# Altium schematic sheet Microcontroller.SchDoc
size A3; Date: 29/01/2025; Engineer: Emirhan BOZKURT; SheetNumber: 4; SheetTotal: 5; PageSize: A3; Position: R&D Electronics Engineer
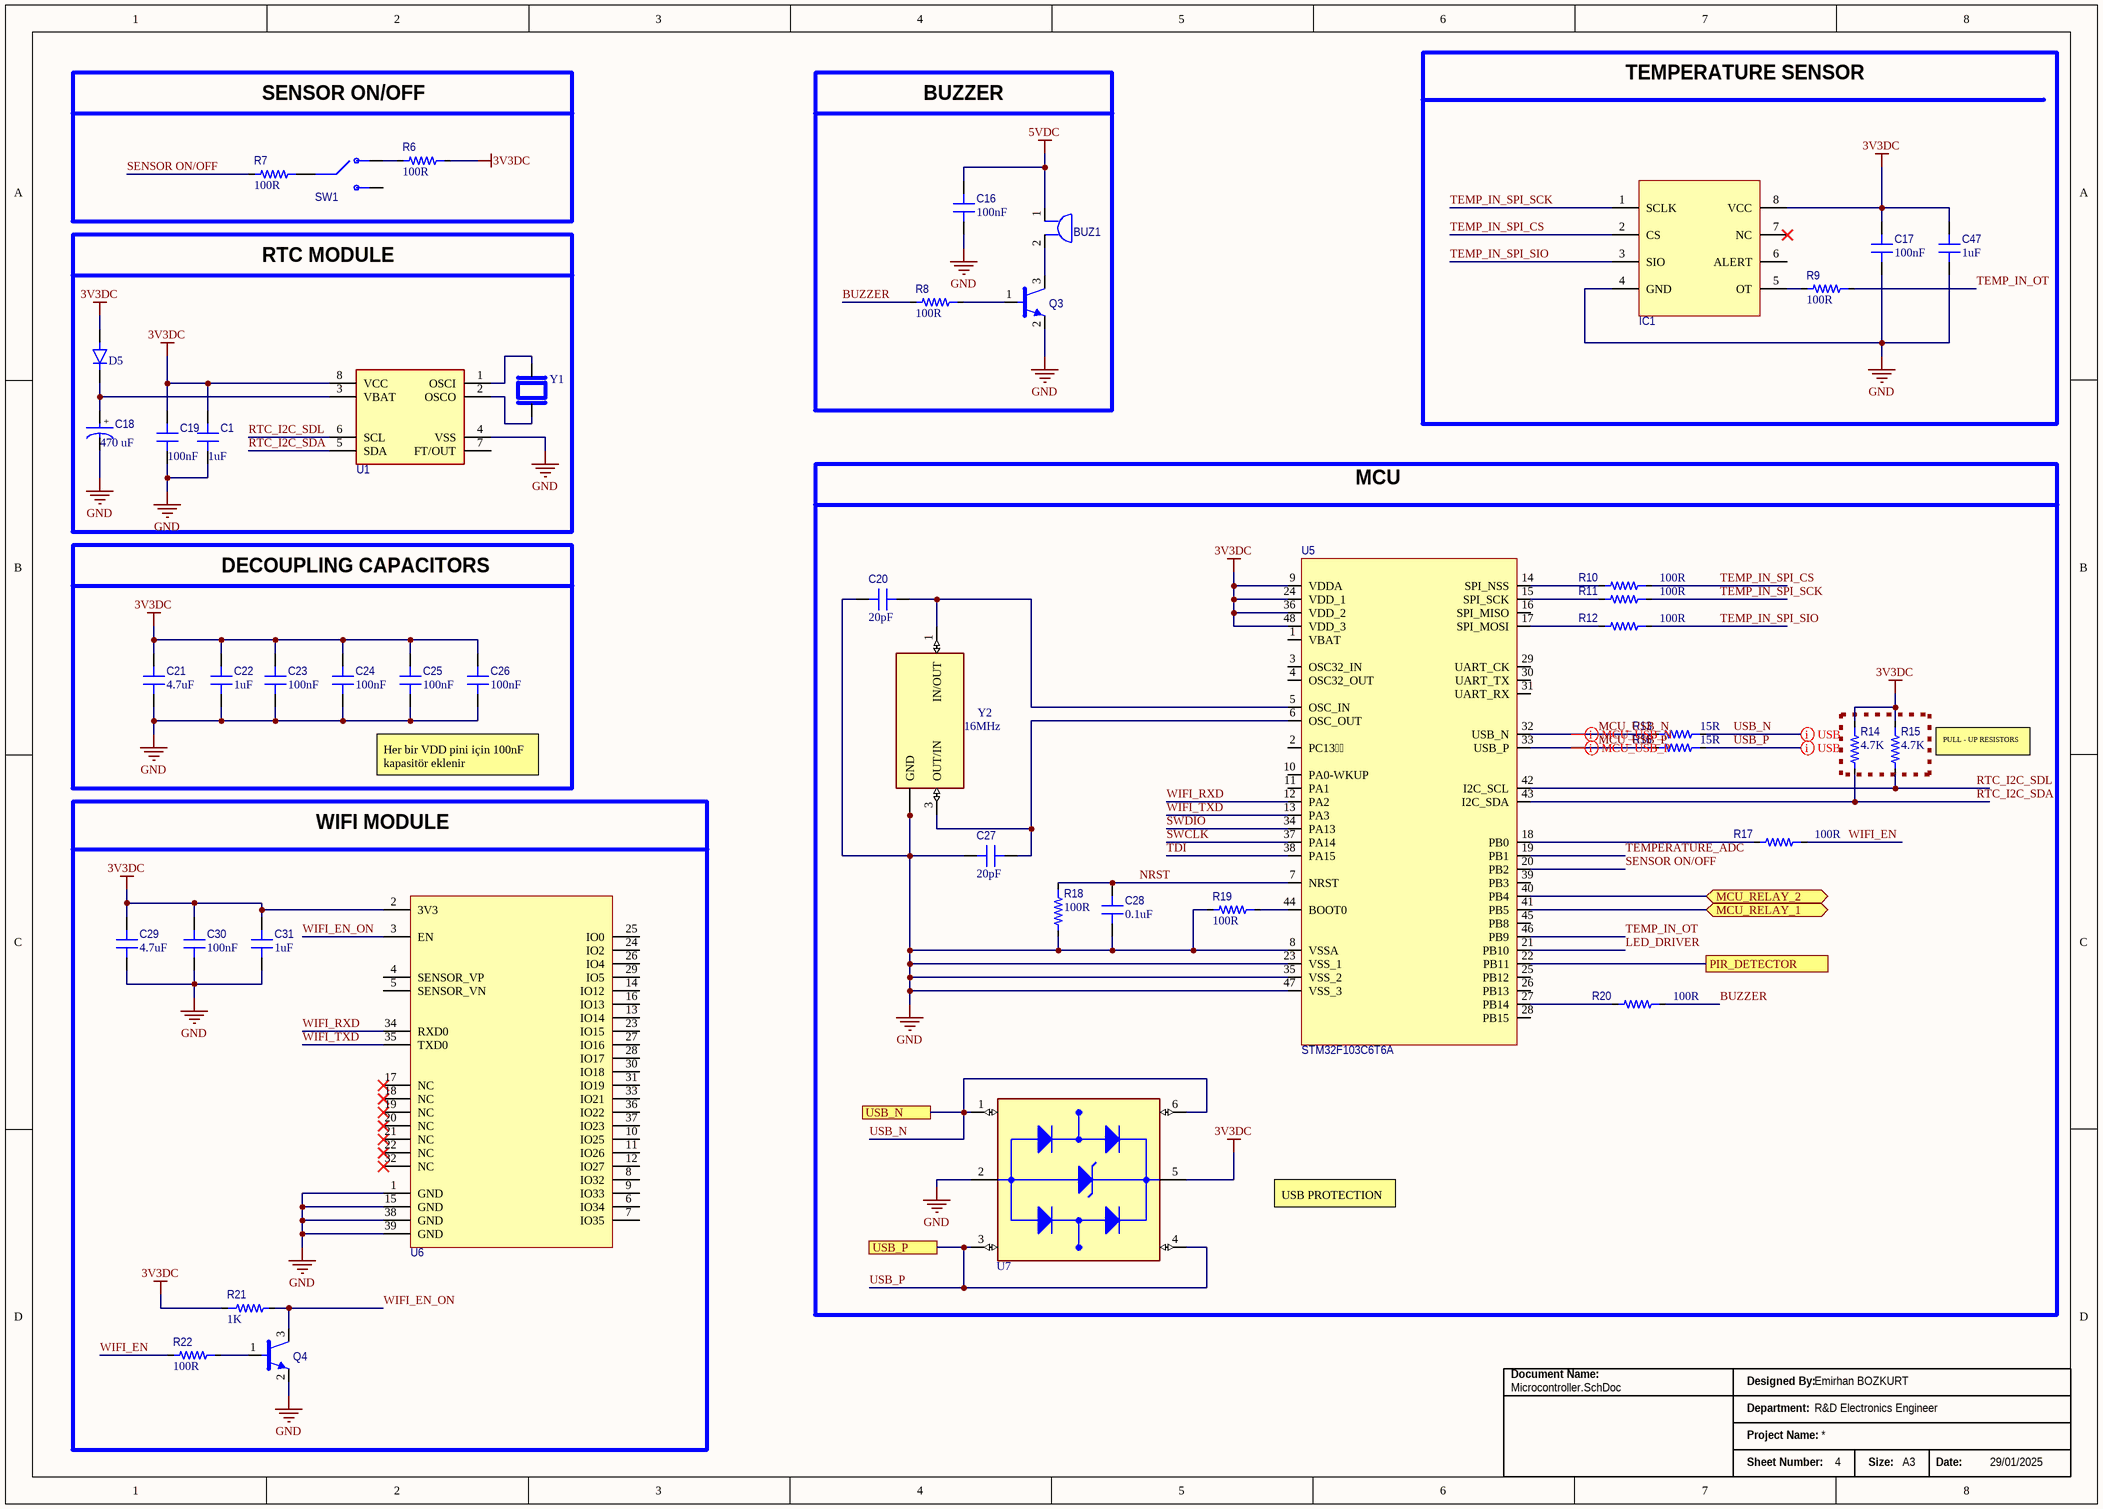
[diagram p0: Microcontroller.SchDoc]

## Parts
BUZ1  CMI-9605IC-0580T  [CMI-9605IC-0580T]  (value not drawn)
C1  value 1uF  [CAP_0805]  (hidden comment: CL21B105KBFNNNE)
C16  value 100nF  [CAP_0805]  (hidden comment: 1276-1003-2-ND)
C17  value 100nF  [CAP_0805]  (hidden comment: 1276-1003-2-ND)
C18  value 470 uF  [CAP_ALU_470UF_SMD]  (hidden comment: PCR1E471MCL1GS)
C19  value 100nF  [CAP_0805]  (hidden comment: 1276-1003-2-ND)
C20  value 20pF  [CAP_0603]  (hidden comment: C0603C104K4RACTU)
C21  value 4.7uF  [CAP_0805]  (hidden comment: CL21A475KAQNNNE)
C22  value 1uF  [CAP_0805]  (hidden comment: CL21B105KBFNNNE)
C23  value 100nF  [CAP_0805]  (hidden comment: 1276-1003-2-ND)
C24  value 100nF  [CAP_0805]  (hidden comment: 1276-1003-2-ND)
C25  value 100nF  [CAP_0805]  (hidden comment: 1276-1003-2-ND)
C26  value 100nF  [CAP_0805]  (hidden comment: 1276-1003-2-ND)
C27  value 20pF  [CAP_0603]  (hidden comment: C0603C104K4RACTU)
C28  value 0.1uF  [CAP_0603]  (hidden comment: C0603C104K4RACTU)
C29  value 4.7uF  [CAP_0805]  (hidden comment: CL21A475KAQNNNE)
C30  value 100nF  [CAP_0805]  (hidden comment: 1276-1003-2-ND)
C31  value 1uF  [CAP_0805]  (hidden comment: CL21B105KBFNNNE)
C47  value 1uF  [CAP_0805]  (hidden comment: CL21B105KBFNNNE)
D5  1N4148WS  [1N4148WS]  (value not drawn)
IC1  MAX6662MSA+  [SOIC-8]  (value not drawn)
Q3  MMBT3904-7-F  [SOT-23F]  (value not drawn)
Q4  MMBT3904-7-F  [SOT-23F]  (value not drawn)
R6  value 100R  [RES_0603]  (hidden comment: RC0603FR-07100RL)
R7  value 100R  [RES_0603]  (hidden comment: RC0603FR-07100RL)
R8  value 100R  [RES_0603]  (hidden comment: RC0603FR-07100RL)
R9  value 100R  [RES_0603]  (hidden comment: RC0603FR-07100RL)
R10  value 100R  [RES_0603]  (hidden comment: RC0603FR-07100RL)
R11  value 100R  [RES_0603]  (hidden comment: RC0603FR-07100RL)
R12  value 100R  [RES_0603]  (hidden comment: RC0603FR-07100RL)
R13  value 15R  [RES_0603]  (hidden comment: RC0603FR-0715RL)
R14  value 4.7K  [RES_0603]  (hidden comment: RC0603FR-074K7L)
R15  value 4.7K  [RES_0603]  (hidden comment: RC0603FR-074K7L)
R16  value 15R  [RES_0603]  (hidden comment: RC0603FR-0715RL)
R17  value 100R  [RES_0603]  (hidden comment: RC0603FR-07100RL)
R18  value 100R  [RES_0603]  (hidden comment: RC0603FR-07100RL)
R19  value 100R  [RES_0603]  (hidden comment: RC0603FR-07100RL)
R20  value 100R  [RES_0603]  (hidden comment: RC0603FR-07100RL)
R21  value 1K  [RES_0603]  (hidden comment: RC0603FR-071KL)
R22  value 100R  [RES_0603]  (hidden comment: RC0603FR-07100RL)
SW1  EG1215AA  [EG1215AA]  (value not drawn)
U1  M41T00M6F  [SOIC-8]  (value not drawn)
U5  STM32F103C6T6A  [LQFP-48]
U6  ESP32-WROOM-32E-N4  [ESP32-WROOM-32E]  (value not drawn)
U7  USBLC6-2SC6  [SOT95P280X145-6N]  (value not drawn)
Y1  ABS05-32.768KHZ-T  [XTAL_ABS05-32.768KHZ-T]  (value not drawn)
Y2  value 16MHz  [XTAL_ECS-160-20-30B-TR]  (hidden comment: ECS-160-20-30B-TR)

## Blocks framed on the sheet
TEMPERATURE SENSOR: C17 C47 IC1 R9
SENSOR ON/OFF: R6 R7 SW1
BUZZER: BUZ1 C16 Q3 R8
RTC MODULE: C1 C18 C19 D5 U1 Y1
MCU: C20 C27 C28 R10-R20 U5 U7 Y2
DECOUPLING CAPACITORS: C21-C26
WIFI MODULE: C29-C31 Q4 R21 R22 U6

## Ports
MCU_RELAY_1 (bidir), MCU_RELAY_2 (bidir), PIR_DETECTOR, USB_N, USB_P

## Nets
3V3DC: C1.2 C17.2 C19.2 C21.2 C22.2 C23.2 C24.2 C25.2 C26.2 C29.2 C30.2 C31.2 C47.2 D5.A IC1.8(VCC) R6.2 R14.2 R15.2 R21.2 U1.8(VCC) U5.9(VDDA) U5.24(VDD_1) U5.36(VDD_2) U5.48(VDD_3) U6.2(3V3) U7.5(VBUS)
5VDC: BUZ1.1 C16.2
GND: C1.1 C16.1 C17.1 C18.2 C19.1 C20.1 C21.1 C22.1 C23.1 C24.1 C25.1 C26.1 C27.1 C28.1 C29.1 C30.1 C31.1 C47.1 IC1.4(GND) Q3.2(E) Q4.2(E) R18.1 R19.1 U1.4(VSS) U5.8(VSSA) U5.23(VSS_1) U5.35(VSS_2) U5.47(VSS_3) U6.1(GND) U6.15(GND) U6.38(GND) U6.39(GND) U7.2(GND) Y2.2(GND) Y2.4(GND)
BUZZER: R8.1 R20.2
LED_DRIVER: U5.21(PB10)
MCU_RELAY_1: U5.41(PB5) ; port MCU_RELAY_1
MCU_RELAY_2: U5.40(PB4) ; port MCU_RELAY_2
MCU_USB_N: R13.1 U5.32(USB_N)
MCU_USB_P: R16.1 U5.33(USB_P)
NRST: C28.2 R18.2 U5.7(NRST)
PIR_DETECTOR: U5.22(PB11) ; port PIR_DETECTOR
RTC_I2C_SDA: R14.1 U1.5(SDA) U5.43(I2C_SDA)
RTC_I2C_SDL: R15.1 U1.6(SCL) U5.42(I2C_SCL)
SENSOR ON/OFF: R7.1 U5.20(PB2)
SWCLK: U5.37(PA14)
SWDIO: U5.34(PA13)
TDI: U5.38(PA15)
TEMP_IN_OT: R9.2 U5.46(PB9)
TEMP_IN_SPI_CS: IC1.2(CS) R10.2
TEMP_IN_SPI_SCK: IC1.1(SCLK) R11.2
TEMP_IN_SPI_SIO: IC1.3(SIO) R12.2
TEMPERATURE_ADC: U5.19(PB1)
USB_N: R13.2 U7.1(I/O1_IN) U7.6(I/O1_OUT) ; port USB_N
USB_P: R16.2 U7.3(I/O2_IN) U7.4(I/O2_OUT) ; port USB_P
WIFI_EN: R17.2 R22.1
WIFI_EN_ON: Q4.3(C) R21.1 U6.3(EN)
WIFI_RXD: U5.12(PA2) U6.34(RXD0)
WIFI_TXD: U5.13(PA3) U6.35(TXD0)
NetBUZ1_2: BUZ1.2 Q3.3(C)
NetC18_1: C18.1 D5.C U1.3(VBAT)
NetC20_2: C20.2 U5.5(OSC_IN) Y2.1(IN/OUT)
NetC27_2: C27.2 U5.6(OSC_OUT) Y2.3(OUT/IN)
NetIC1_5: IC1.5(OT) R9.1
NetQ3_1: Q3.1(B) R8.2
NetQ4_1: Q4.1(B) R22.2
NetR6_1: R6.1 SW1.1
NetR7_2: R7.2 SW1.2
NetR10_1: R10.1 U5.14(SPI_NSS)
NetR11_1: R11.1 U5.15(SPI_SCK)
NetR12_1: R12.1 U5.17(SPI_MOSI)
NetR17_1: R17.1 U5.18(PB0)
NetR19_2: R19.2 U5.44(BOOT0)
NetR20_1: R20.1 U5.27(PB14)
NetU1_1: U1.1(OSCI) Y1.2
NetU1_2: U1.2(OSCO) Y1.1

Not connected (* = marked no-connect by the designer): IC1 6(ALERT) 7(NC)*; SW1 3; U1 7(FT/OUT); U5 1(VBAT) 2(PC13) 3(OSC32_IN) 4(OSC32_OUT) 10(PA0-WKUP) 11(PA1) 16(SPI_MISO) 25(PB12) 26(PB13) 28(PB15) 29(UART_CK) 30(UART_TX) 31(UART_RX) 39(PB3) 45(PB8); U6 4(SENSOR_VP) 5(SENSOR_VN) 6(IO34) 7(IO35) 8(IO32) 9(IO33) 10(IO25) 11(IO26) 12(IO27) 13(IO14) 14(IO12) 16(IO13) 17(NC)* 18(NC)* 19(NC)* 20(NC)* 21(NC)* 22(NC)* 23(IO15) 24(IO2) 25(IO0) 26(IO4) 27(IO16) 28(IO17) 29(IO5) 30(IO18) 31(IO19) 32(NC)* 33(IO21) 36(IO22) 37(IO23)

## Layout directives
differential pair: MCU_USB_N, MCU_USB_P, USB_N, USB_P

## Notes on the sheet
- Her bir VDD pini için 100nF kapasitör eklenir
- (near R15) PULL - UP RESISTORS
- USB PROTECTION
- Document Name:
- Designed By:
- Department:
- Project Name:
- Sheet Number:
- Size:
- Date:
- (in symbol CAP ALU 470uF SMD) +

## Library data of the parts
BUZ1 = CMI-9605IC-0580T: BUZZER MAGNETIC 5V 9.6MM TH; Max Supply Voltage: 7V; Min Supply Voltage: 3V; Designed By: Emirhan Bozkurt; Supplier Part Number: 2223-CMI-9605IC-0580T-ND; Supplier 1: DigiKey; Mounting Type: TH; Size: 9.6mm; Case Package: CMI-9605IC; Manufacturer Product Number: CMI-9605IC-0580T
C1 C22 C31 C47 = CAP CER 1uF 0805: CAP CER 1uF 25V X5R 0805; Manufacturer: Samsung Electro-Mechanics; Designed By: Emirhan Bozkurt; Supplier Part Number: 1276-1029-1-ND; Supplier 1: DigiKey; Case Package: 0805; Mounting Type: Surface Mount; Manufacturer Product Number: CL21B105KBFNNNE
C16 C17 C19 C23-C26 C30 = CAP CER 100nF 0805: CAP CER 0.1uF 50V X7R 0805; Designed By: Emirhan Bozkurt; Supplier Part Number: 1276-1003-2-ND; Supplier 1: DigiKey; Case Package: 0805; Mounting Type: Surface Mount; Manufacturer Product Number: 1276-1003-2-ND
C18 = CAP ALU 470uF SMD: CAP ALUM POLY 470uF 20% 25V SMD; Manufacturer: Nichicon; Designed By: Emirhan Bozkurt; Parameter 1: DigiKey; Supplier Part Number: 493-13756-2-ND; Supplier 1: Digi Key; Mounting Type: Surface Mount; Supply Voltage: 25V; Category: Aluminum - Polymer Capacitors; Manufacturer Product Number: PCR1E471MCL1GS
C20 C27 = CAP CER 20pF 0603: CAP CER 20pF 50V C0G/NP0 0603; Manufacturer: Samsung Electro-Mechanics; Designed By: Emirhan Bozkurt; Supplier Part Number: 1276-1187-2-ND; Supplier 1: DigiKey; Case Package: 0603; Mounting Type: Surface Mount; Manufacturer Product Number: C0603C104K4RACTU
C21 C29 = CAP CER 4.7uF 0805: CAP CER 4.7uF 25V X5R 0805; Manufacturer: Samsung Electro-Mechanics; Designed By: Emirhan Bozkurt; Supplier Part Number: CL21A475KAQNNNE; Supplier 1: DigiKey; Case Package: 0805; Mounting Type: Surface Mount; Manufacturer Product Number: CL21A475KAQNNNE
C28 = CAP CER 0.1uF 0603: CAP CER 0.1uF 16V X7R 0603; Manufacturer: Samsung Electro-Mechanics; Designed By: Emirhan Bozkurt; Supplier Part Number: 399-C0603C104K4RACTUTR-ND; Supplier 1: DigiKey; Case Package: 0603; Mounting Type: Surface Mount; Manufacturer Product Number: C0603C104K4RACTU
D5 = 1N4148WS: DIODE STANDARD 75V 150MA SOD323F; Manufacturer: Diotec Semiconductor; Designed By: Emirhan Bozkurt; Supplier 1: DigiKey; Case Package: SOD-323F Diotec; Value: *; Supplier Part Number: 1N4148WSFSTR-ND; Check_prices: https://www.snapeda.com/parts/1N4148WS/Diotec/view-part/?ref=eda; Manufacturer Product Number: 1N4148WS
IC1 = MAX6662MSA+: TEMPERATURE SENSOR DIGITAL REMOTE 8SOIC; Designed By: Emirhan Bozkurt; Supplier Part Number: MAX6662MSA+-ND; Supplier 1: DigiKey; Max Operating Temperature: +150; Min Operating Temperature: -55; Case Package: SOIC-8; Manufacturer Product Number: MAX6662MSA+
Q3 Q4 = MMBT3904-7-F: TRANS NPN 40V 0.2A SOT-23-3; Parameter 1: Surface Mount; Supplier Part Number: MMBT3904-FDICT-ND; Supplier 1: DigiKey; ComponentLink1Description: Datasheet; ComponentLink1URL: https://www.digikey.com/en/products/detail/toshiba-semiconductor-and-storage/SSM3K357R-LF/8611159; FET Type: NPN; Voltage - Collector Emitter: 40V; Case Package: SOT-23-3; Manufacturer Product Number: MMBT3904-7-F
R6-R12 R17-R20 R22 = RES 100R 0603: RES 100 OHM 1% 1/10W 0603; Suppier Part Number: 311-100HRTR-ND; Manufacturer: YAGEO; Designed By: Emirhan Bozkurt; Supplier 1: DigiKey; Case Package: 0603; Mounting Type: Surface Mount; Category: Chip Resistor; Manufacturer Product Number: RC0603FR-07100RL
R13 R16 = RES 15R 0603: RES 15 OHM 1% 1/10W 0603; Suppier Part Number: 311-15.0HRTR-ND; Manufacturer: YAGEO; Designed By: Emirhan Bozkurt; Supplier 1: DigiKey; Case Package: 0603; Mounting Type: Surface Mount; Category: Chip Resistor; Manufacturer Product Number: RC0603FR-0715RL
R14 R15 = RES 4K7 0603: RES 4K7 OHM 1% 1/10W 0603; Suppier Part Number: 311-4.70KHRCT-ND; Manufacturer: YAGEO; Designed By: Emirhan Bozkurt; Supplier 1: DigiKey; Case Package: 0603; Mounting Type: Surface Mount; Category: Chip Resistor; Manufacturer Product Number: RC0603FR-074K7L
R21 = RES 1K 0603: RES 1K 1% 1/10W 0603; Suppier Part Number: 311-1.00KHRCT-ND; Manufacturer: YAGEO; Designed By: Emirhan Bozkurt; Supplier 1: DigiKey; Case Package: 0603; Mounting Type: Surface Mount; Category: Chip Resistor; Manufacturer Product Number: RC0603FR-071KL
SW1 = EG1215AA: SWITCH SLIDE SPDT 25MA 24V; Designed By: Emirhan Bozkurt; Supplier Part Number: EG5720TR-ND; Supplier 1: DigiKey; Max Supply Voltage: 24V; Current: 25mA; Mounting Type: Surface Mount; Manufacturer Product Number: EG1215AA
U1 = M41T00M6F: IC RTC CLK/CALENDAR I2C 8SOIC; Voltage - Supply: 2V ~ 5.5V; Current: 70µA; Designed By: Emirhan BOZKURT; Supplier Part Number: 497-4697-2-ND; Package/Case: 8-SOIC; Mounting Type: Surface Mount; Supplier 1: DigiKey; Case Package: SOIC-8; Manufacturer Product Number: M41T00M6F
U5 = STM32F103C6T6A: IC MCU 32BIT 32KB FLASH 48LQFP; Voltage: 2V ~ 3.6V; Designed By: Emirhan Bozkurt; Supplier Part Number: 497-11515-ND; Supplier 1: DigiKey; Case Package: 48-LQFP; Mounting Type: Surface Mount; ComponentLink1Description: Datasheet; ComponentLink1URL: https://www.st.com/content/ccc/resource/technical/document/datasheet/0d/93/e0/d7/77/bf/4c/54/CD00210843.pdf/files/CD00210843.pdf/jcr:content/translations/en.CD00210843.pdf; Manufacturer Product Number: STM32F103C6T6A
U6 = ESP32-WROOM-32E-N4: RF TXRX MOD BT WIFI TH SMD; Supply Voltage Nominal: 3V3; Designed By: Emirhan Bozkurt; Frequency: 2.4GHz ~ 2.5GHz; Supplier Part Number: 1965-ESP32-WROOM-32E-N4TR-ND; Max Operating Temperature: 85 °C; Min Operating Temperature: -45 °C; ComponentLink1Description: Datasheet; ComponentLink1URL: https://www.espressif.com/sites/default/files/documentation/esp32-wroom-32e_esp32-wroom-32ue_datasheet_en.pdf; Supplier 1: DigiKey; Manufacturer Product Number: ESP32-WROOM-32E-N4
U7 = USB PROTECTION: TVS DIODE 5.25VWM 17VC SOT23-6; Manufacturer: STMicroelectronics; Designed By: Emirhan Bozkurt; Supplier 1: DigiKey; Case Package: SOT-23-6 STMicroelectronics; Supplier Part Number: 497-5235-2-ND; Manufacturer Product Number: USBLC6-2SC6
Y1 = ABS05-32.768KHZ-T: CRYSTAL 32.7680KHZ 12.5PF SMD; Suppler Part Number: 535-11899-2-ND; Designed By: Emirhan Bozkurt; Supplier 1: DigiKey; Mounting Type: Surface Mount; Series: ABS05; Value: 32.768 kHz; Manufacturer Product Number: ABS05-32.768KHZ-T
Y2 = ECS-160-20-30B-TR: CRYSTAL 16.0000MHZ 20PF SMD; Designed By: Emirhan Bozkurt; Supplier 1: DigiKey; Supplier Part Number: XC1120TR-ND; Series: ECX-53B; Manufacturer Product Number: ECS-160-20-30B-TR